# Altium project Hardware.PrjPcb
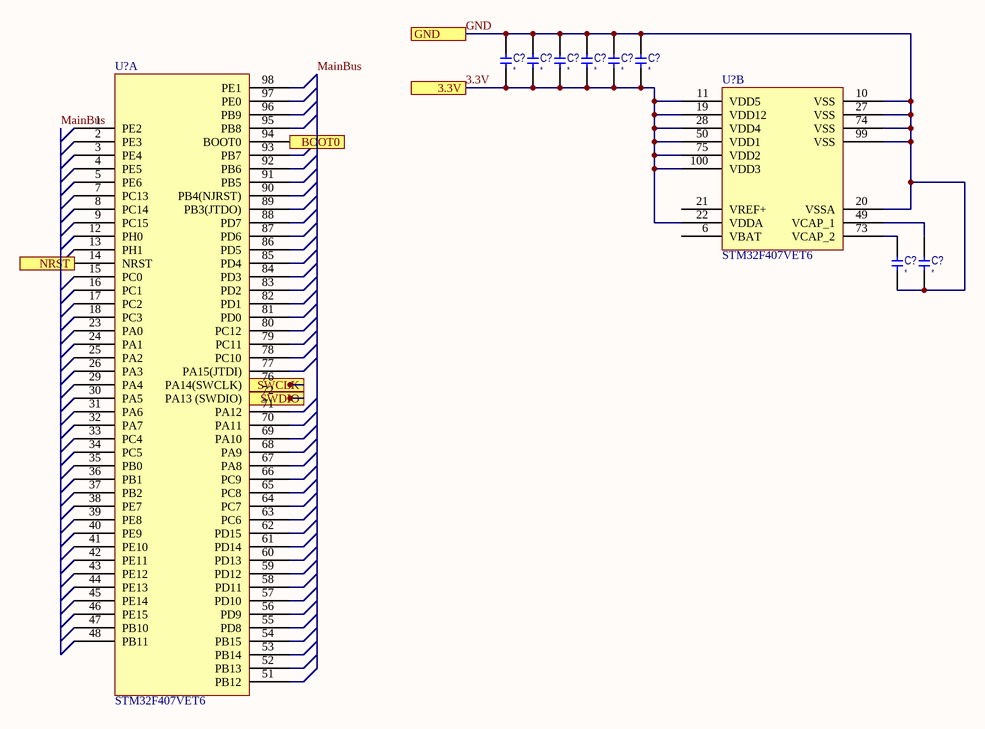
[diagram p0: Sheet1.SchDoc]
1 sheet, 10 parts. Net scope: flat (ports and power ports of the same name join across sheets).
Board file: Hardware.PcbDoc

## Sheet Sheet1.SchDoc
size A4; SheetNumber: 1; SheetTotal: 1

### Parts
(Parts that share a designator on the sheet are numbered #1, #2 ... from top to bottom, then left to right.)
C?#1  (no value)  [CERCAP 0805]
C?#2  (no value)  [CERCAP 0805]
C?#3  (no value)  [CERCAP 0805]
C?#4  (no value)  [CERCAP 0805]
C?#5  (no value)  [CERCAP 0805]
C?#6  (no value)  [CERCAP 0805]
C?#7  (no value)  [CERCAP 1206]
C?#8  (no value)  [CERCAP 1206]
U?#1  STM32F407VET6  [LQFP100]  (part B of 2)
U?#2  STM32F407VET6  [LQFP100]  (part A of 2)

### Ports
3.3V, BOOT0, GND, NRST, SWCLK, SWDIO

### Nets
3.3V: C?#1.1 C?#2.1 C?#3.1 C?#4.1 C?#5.1 C?#6.1 U?#1.11(VDD5) U?#1.19(VDD12) U?#1.22(VDDA) U?#1.28(VDD4) U?#1.50(VDD1) U?#1.75(VDD2) U?#1.100(VDD3) ; port 3.3V
GND: C?#1.2 C?#2.2 C?#3.2 C?#4.2 C?#5.2 C?#6.2 C?#7.2 C?#8.2 U?#1.10(VSS) U?#1.20(VSSA) U?#1.27(VSS) U?#1.74(VSS) U?#1.99(VSS) ; port GND
NetC?#7_1: C?#7.1 U?#1.73(VCAP_2)
NetC?#8_1: C?#8.1 U?#1.49(VCAP_1)
NetU?#2_14: U?#2.14(NRST) ; port NRST
NetU?#2_72: U?#2.72(PA13_(SWDIO)) ; port SWDIO
NetU?#2_76: U?#2.76(PA14(SWCLK)) ; port SWCLK
NetU?#2_94: U?#2.94(BOOT0) ; port BOOT0

Not connected (* = marked no-connect by the designer): U?#1 6(VBAT) 21(VREF+); U?#2 1(PE2) 2(PE3) 3(PE4) 4(PE5) 5(PE6) 7(PC13) 8(PC14) 9(PC15) 12(PH0) 13(PH1) 15(PC0) 16(PC1) 17(PC2) 18(PC3) 23(PA0) 24(PA1) 25(PA2) 26(PA3) 29(PA4) 30(PA5) 31(PA6) 32(PA7) 33(PC4) 34(PC5) 35(PB0) 36(PB1) 37(PB2) 38(PE7) 39(PE8) 40(PE9) 41(PE10) 42(PE11) 43(PE12) 44(PE13) 45(PE14) 46(PE15) 47(PB10) 48(PB11) 51(PB12) 52(PB13) 53(PB14) 54(PB15) 55(PD8) 56(PD9) 57(PD10) 58(PD11) 59(PD12) 60(PD13) 61(PD14) 62(PD15) 63(PC6) 64(PC7) 65(PC8) 66(PC9) 67(PA8) 68(PA9) 69(PA10) 70(PA11) 71(PA12) 77(PA15(JTDI)) 78(PC10) 79(PC11) 80(PC12) 81(PD0) 82(PD1) 83(PD2) 84(PD3) 85(PD4) 86(PD5) 87(PD6) 88(PD7) 89(PB3(JTDO)) 90(PB4(NJRST)) 91(PB5) 92(PB6) 93(PB7) 95(PB8) 96(PB9) 97(PE0) 98(PE1)

### Buses and harness runs
bus MainBus

### Library data of the parts
C?#1-C?#8 = !Capacitor: Capacitor; IsSMT: NoSMT; Diel: X7R; Voltage: *; Value: *
U?#1 U?#2 = STM32F40x (100): 32 ARM microcontroller; DefaultOrder: STM32F407VET6; Order: *